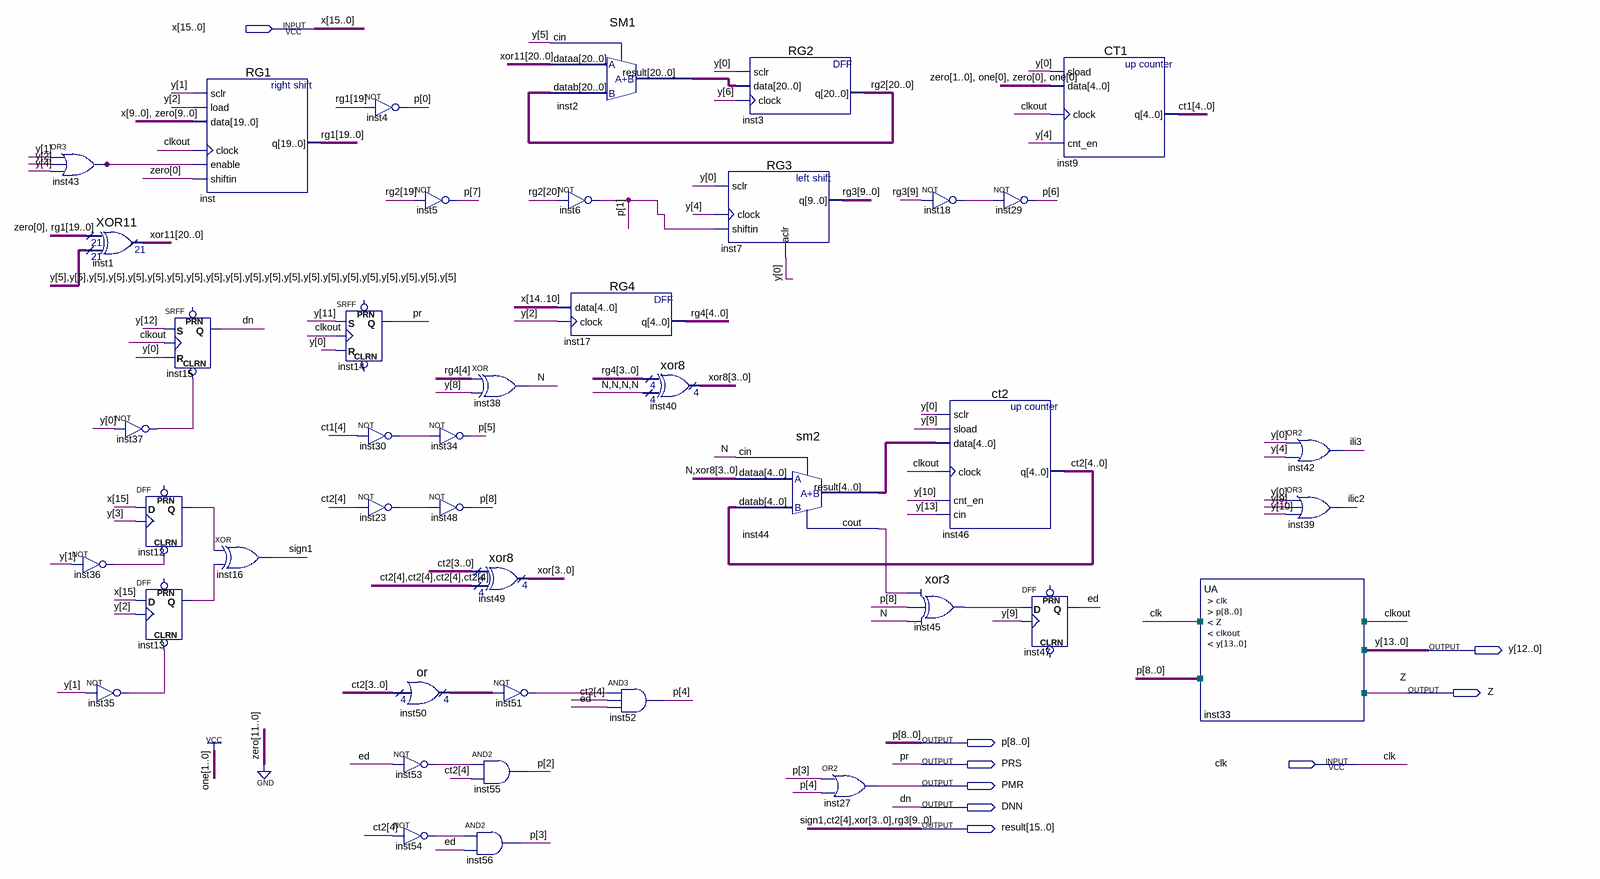
[diagram p0: schematic sheet]
// Quartus schematic DivK.bdf as structural Verilog: 43 symbols, 9 pins
module DivK (
  input  [15:0] x,
  input  clk,
  output [13:0] y,
  output Z,
  output [8:0] p,
  output PRS,
  output PMR,
  output DNN,
  output [15:0] result
);

  wire clkout, ed, ili3, ilic2, inst12_q, inst13_q, inst18_out, inst23_out, inst30_out, inst35_out,
       inst36_out, inst37_out, inst43_out, inst44_cout, inst45_result, inst51_out, inst53_out, inst54_out, N;
  wire [3:0] ct2, inst50_result, xor8;
  wire [4:0] ct1, inst44_result, rg4;
  wire [19:0] rg1;
  wire [20:0] inst2_result, rg2, xor11;

  or inst43 (inst43_out, y[1], y[2], y[4]);
  not inst36 (inst36_out, y[1]);
  XOR11 inst1 (.data0x({1'b0, rg1}), .data1x({21{y[5]}}), .result(xor11));
  not inst37 (inst37_out, y[0]);
  DFF inst12 (.CLRN(inst36_out), .CLK(y[3]), .D(x[15]), .Q(inst12_q));  // open: PRN
  DFF inst13 (.CLRN(inst35_out), .CLK(y[2]), .D(x[15]), .Q(inst13_q));  // open: PRN
  not inst35 (inst35_out, y[1]);
  RG1 inst (
    .sclr(y[1]), .load(y[2]), .data({x[9:0], {10{1'b0}}}), .clock(clkout), .enable(inst43_out),
    .shiftin(1'b0), .q(rg1));
  SRFF inst15 (.CLRN(inst37_out), .S(y[12]), .R(y[0]), .CLK(clkout), .Q(DNN));  // open: PRN
  xor inst16 (result[15], inst12_q, inst13_q);
  not inst4 (p[0], rg1[19]);
  SRFF inst14 (.S(y[11]), .R(y[0]), .CLK(clkout), .Q(PRS));  // open: PRN, CLRN
  not inst30 (inst30_out, ct1[4]);
  not inst23 (inst23_out, result[14]);
  not inst5 (p[7], rg2[19]);
  \or  inst50 (.data0x(ct2), .result(inst50_result));
  not inst53 (inst53_out, ed);
  not inst54 (inst54_out, result[14]);
  xor inst38 (N, rg4[4], y[8]);
  not inst34 (p[5], inst30_out);
  not inst48 (p[8], inst23_out);
  xor8 inst49 (.data0x(ct2), .data1x({4{result[14]}}), .result(result[13:10]));
  and inst55 (p[2], inst53_out, result[14]);
  and inst56 (p[3], inst54_out, ed);
  assign inst51_out = ~inst50_result;  // NOT inst51, 4 bits wide
  SM1 inst2 (.dataa(xor11), .datab(rg2), .cin(y[5]), .result(inst2_result));
  not inst6 (p[1], rg2[20]);
  RG4 inst17 (.data(x[14:10]), .clock(y[2]), .q(rg4));
  xor8 inst40 (.data0x(rg4[3:0]), .data1x({4{N}}), .result(xor8));
  and inst52 (p[4], inst51_out, result[14], ed);
  RG2 inst3 (.sclr(y[0]), .data(inst2_result), .clock(y[6]), .q(rg2));
  RG3 inst7 (.sclr(y[0]), .clock(y[4]), .shiftin(p[1]), .aclr(y[0]), .q(result[9:0]));
  sm2 inst44 (.dataa({N, xor8}), .datab({result[14], ct2}), .cin(N), .result(inst44_result), .cout(inst44_cout));
  or inst27 (PMR, p[3], p[4]);
  not inst18 (inst18_out, result[9]);
  ct2 inst46 (
    .sclr(y[0]), .sload(y[9]), .data(inst44_result), .clock(clkout), .cnt_en(y[10]), .cin(y[13]),
    .q({result[14], ct2}));
  xor3 inst45 (.data0(inst44_cout), .data1(p[8]), .data2(N), .result(inst45_result));
  not inst29 (p[6], inst18_out);
  CT1 inst9 (.sload(y[0]), .data(5'b00101), .clock(clkout), .cnt_en(y[4]), .q(ct1));
  DFF inst47 (.CLK(y[9]), .D(inst45_result), .Q(ed));  // open: CLRN, PRN
  UA inst33 (.clk(clk), .p(p), .Z(Z), .clkout(clkout), .y(y));
  or inst42 (ili3, y[0], y[4]);
  or inst39 (ilic2, y[0], y[9], y[10]);

  // Other names for the same wires on the sheet: ct2[4] = result[14]; dn = DNN; pr = PRS; rg3[9:0] = result[9:0];
  //   sign1 = result[15]; xor[3:0] = result[13:10]
endmodule
